# Altium schematic sheet Idea_Sheet.SchDoc
size A4; SheetNumber: 1; SheetTotal: 8
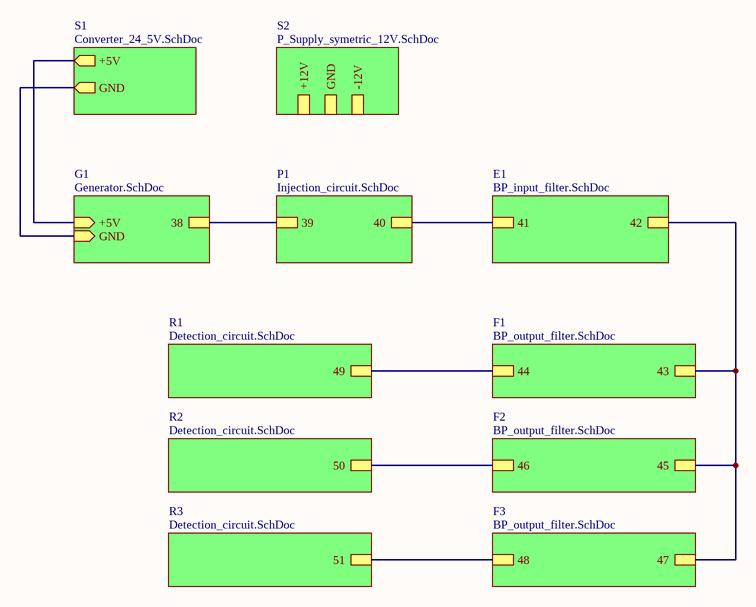
[diagram p0: Idea_Sheet.SchDoc]

## Sub-sheets
E1 = BP_input_filter.SchDoc: 41, 42
F1 = BP_output_filter.SchDoc: 43, 44
F2 = BP_output_filter.SchDoc: 45, 46
F3 = BP_output_filter.SchDoc: 47, 48
G1 = Generator.SchDoc: 38, +5V (in), GND (in)
P1 = Injection_circuit.SchDoc: 39, 40
R1 = Detection_circuit.SchDoc: 49
R2 = Detection_circuit.SchDoc: 50
R3 = Detection_circuit.SchDoc: 51
S1 = Converter_24_5V.SchDoc: +5V (out), GND (out)
S2 = P_Supply_symetric_12V.SchDoc: +12V, GND, -12V

## Nets
(unnamed): sheet G1/38, sheet P1/39
(unnamed): sheet G1/+5V, sheet S1/+5V
(unnamed): sheet G1/GND, sheet S1/GND
(unnamed): sheet E1/41, sheet P1/40
(unnamed): sheet E1/42, sheet F1/43, sheet F2/45, sheet F3/47
(unnamed): sheet R1/49, sheet F1/44
(unnamed): sheet F2/46, sheet R2/50
(unnamed): sheet F3/48, sheet R3/51